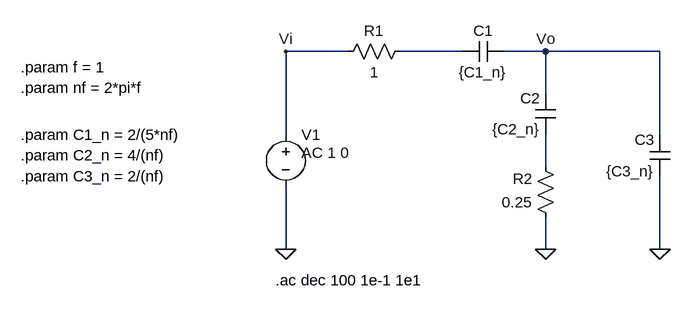
[diagram p0: schematic TPS11_ej2.asc]
TPS11_ej2.asc, the LTspice schematic file:
Version 4
SHEET 1 880 680
WIRE -1120 -544 -1216 -544
WIRE -944 -544 -1040 -544
WIRE -816 -544 -880 -544
WIRE -640 -544 -816 -544
WIRE -816 -480 -816 -544
WIRE -1216 -416 -1216 -544
WIRE -640 -416 -640 -544
WIRE -816 -368 -816 -416
WIRE -1216 -240 -1216 -336
WIRE -816 -240 -816 -288
WIRE -640 -240 -640 -352
FLAG -1216 -240 0
FLAG -816 -240 0
FLAG -640 -240 0
FLAG -1216 -544 Vi
FLAG -816 -544 Vo
SYMBOL cap -880 -560 R90
WINDOW 0 0 32 VBottom 2
WINDOW 3 32 32 VTop 2
SYMATTR InstName C1
SYMATTR Value {C1_n}
SYMBOL voltage -1216 -432 R0
WINDOW 123 24 44 Left 2
WINDOW 39 0 0 Left 2
SYMATTR Value2 AC 1 0
SYMATTR InstName V1
SYMATTR Value ""
SYMBOL cap -800 -416 R180
WINDOW 0 24 56 Left 2
WINDOW 3 24 8 Left 2
SYMATTR InstName C2
SYMATTR Value {C2_n}
SYMBOL cap -624 -352 R180
WINDOW 0 24 56 Left 2
WINDOW 3 24 8 Left 2
SYMATTR InstName C3
SYMATTR Value {C3_n}
SYMBOL res -1024 -560 R90
WINDOW 0 0 56 VBottom 2
WINDOW 3 32 56 VTop 2
SYMATTR InstName R1
SYMATTR Value 1
SYMBOL res -800 -272 R180
WINDOW 0 36 76 Left 2
WINDOW 3 36 40 Left 2
SYMATTR InstName R2
SYMATTR Value 0.25
TEXT -1232 -192 Left 2 !.ac dec 100 1e-1 1e1
TEXT -1624 -416 Left 2 !.param C1_n = 2/(5*nf)
TEXT -1624 -384 Left 2 !.param C2_n = 4/(nf)
TEXT -1624 -352 Left 2 !.param C3_n = 2/(nf)
TEXT -1624 -520 Left 2 !.param f = 1
TEXT -1624 -488 Left 2 !.param nf = 2*pi*f

The netlist it stands for:
* TPS11_ej2.asc
C1 Vo N001 {C1_n}
V1 Vi 0 AC 1 0
C2 N002 Vo {C2_n}
C3 0 Vo {C3_n}
R1 N001 Vi 1
R2 0 N002 0.25
.ac dec 100 1e-1 1e1
.param C1_n = 2/(5*nf)
.param C2_n = 4/(nf)
.param C3_n = 2/(nf)
.param f = 1
.param nf = 2*pi*f
.backanno
.end